# EasyEDA schematic NixieClock_v1.02_easyEDA.json
TITLE: Nixie Tube; REV: 1.0; Date: 2018-09-02; Sheet: 1/1; Drawn By: lc85301
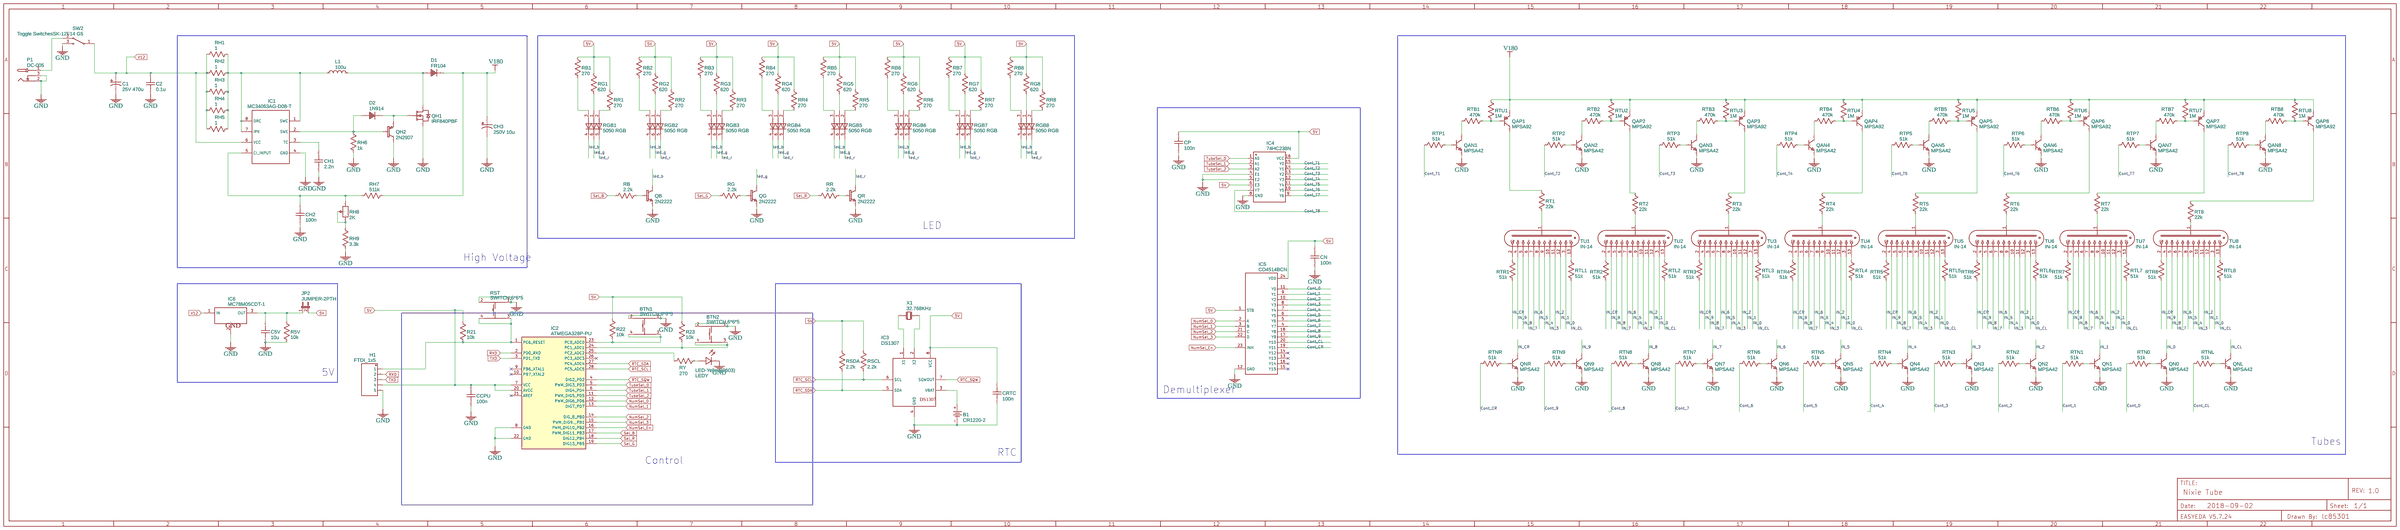
[diagram p0: schematic sheet]

## Parts
B1  CR1220-2  [BH5000_SMALL]
BTN1  SWITCH,6*6*5  [SWITCH-6X6X5_TH]
BTN2  SWITCH,6*6*5  [SWITCH-6X6X5_TH]
C1  25V 470u  [CAP-D8.0XF3.5]
C2  0.1u  [RAD-0.2]
C5V  10u  [RAD-0.2]
CCPU  100n  [0603]
CH1  2.2n  [RAD-0.2]
CH2  100n  [0603]
CH3  250V 10u  [CAP-D10.0XF5.0]
CN  100n  [0603]
CP  100n  [0603]
CRTC  100n  [0603]
D1  FR104  [DO-41]
D2  1N914  [DO-35]
H1  FTDI_1x5  [DIP-1X5P-2.54MM-M]
IC1  MC34063AG-D08-T  [DIL08]
IC2  ATMEGA328P-PU  [DIP28]
IC3  DS1307  [DIL08]
IC4  74HC238N  [DIP16-2.54-20.32X5.84MM]
IC5  CD4514BCN  [DIP24W]
IC6  MC78M05CDT-1  [369-03]
JP2  JUMPER-2PTH  [1X02]
L1  100u  [COIL-TOROID-100UH-6A]
LEDY  LED-Yellow(0603)  [LED-0603]
P1  DC-005  [DC-005]
QAN1  MPSA42  [TO-226AA]
QAN2  MPSA42  [TO-226AA]
QAN3  MPSA42  [TO-226AA]
QAN4  MPSA42  [TO-226AA]
QAN5  MPSA42  [TO-226AA]
QAN6  MPSA42  [TO-226AA]
QAN7  MPSA42  [TO-226AA]
QAN8  MPSA42  [TO-226AA]
QAP1  MPSA92  [TO-226AA]
QAP2  MPSA92  [TO-226AA]
QAP3  MPSA92  [TO-226AA]
QAP4  MPSA92  [TO-226AA]
QAP5  MPSA92  [TO-226AA]
QAP6  MPSA92  [TO-226AA]
QAP7  MPSA92  [TO-226AA]
QAP8  MPSA92  [TO-226AA]
QB  2N2222  [TO-92]
QG  2N2222  [TO-92]
QH1  IRF840PBF  [TO-220(TO-220-3)]
QH2  2N2907  [TO-226AA]
QN0  MPSA42  [TO-226AA]
QN1  MPSA42  [TO-226AA]
QN2  MPSA42  [TO-226AA]
QN3  MPSA42  [TO-226AA]
QN4  MPSA42  [TO-226AA]
QN5  MPSA42  [TO-226AA]
QN6  MPSA42  [TO-226AA]
QN7  MPSA42  [TO-226AA]
QN8  MPSA42  [TO-226AA]
QN9  MPSA42  [TO-226AA]
QNL  MPSA42  [TO-226AA]
QNR  MPSA42  [TO-226AA]
QR  2N2222  [TO-92]
R5V  10k  [0603]
R21  10k  [0603]
R22  10k  [0603]
R23  10k  [0603]
RB  2.2k  [0603]
RB1  270  [R_0603]
RB2  270  [R_0603]
RB3  270  [R_0603]
RB4  270  [R_0603]
RB5  270  [R_0603]
RB6  270  [R_0603]
RB7  270  [R_0603]
RB8  270  [R_0603]
RG  2.2k  [0603]
RG1  620  [R_0603]
RG2  620  [R_0603]
RG3  620  [R_0603]
RG4  620  [R_0603]
RG5  620  [R_0603]
RG6  620  [R_0603]
RG7  620  [R_0603]
RG8  620  [R_0603]
RGB1  5050 RGB  [5050_KINGBRIGHT]
RGB2  5050 RGB  [5050_KINGBRIGHT]
RGB3  5050 RGB  [5050_KINGBRIGHT]
RGB4  5050 RGB  [5050_KINGBRIGHT]
RGB5  5050 RGB  [5050_KINGBRIGHT]
RGB6  5050 RGB  [5050_KINGBRIGHT]
RGB7  5050 RGB  [5050_KINGBRIGHT]
RGB8  5050 RGB  [5050_KINGBRIGHT]
RH1  1  [1206]
RH2  1  [1206]
RH3  1  [1206]
RH4  1  [1206]
RH5  1  [1206]
RH6  1k  [AXIAL-0.4]
RH7  511k  [AXIAL-0.4]
RH8  2K  [RES-ADJ_3362P]
RH9  3.3k  [AXIAL-0.4]
RR  2.2k  [0603]
RR1  270  [R_0603]
RR2  270  [R_0603]
RR3  270  [R_0603]
RR4  270  [R_0603]
RR5  270  [R_0603]
RR6  270  [R_0603]
RR7  270  [R_0603]
RR8  270  [R_0603]
RSCL  2.2k  [0603]
RSDA  2.2k  [0603]
RST  SWITCH,6*6*5  [SWITCH-6X6X5_TH]
RT1  22k  [R_0603]
RT2  22k  [R_0603]
RT3  22k  [R_0603]
RT4  22k  [R_0603]
RT5  22k  [R_0603]
RT6  22k  [R_0603]
RT7  22k  [R_0603]
RT8  22k  [R_0603]
RTB1  470k  [R_0603]
RTB2  470k  [R_0603]
RTB3  470k  [R_0603]
RTB4  470k  [R_0603]
RTB5  470k  [R_0603]
RTB6  470k  [R_0603]
RTB7  470k  [R_0603]
RTB8  470k  [R_0603]
RTL1  51k  [R_0603]
RTL2  51k  [R_0603]
RTL3  51k  [R_0603]
RTL4  51k  [R_0603]
RTL5  51k  [R_0603]
RTL6  51k  [R_0603]
RTL7  51k  [R_0603]
RTL8  51k  [R_0603]
RTN0  51k  [R_0603]
RTN1  51k  [R_0603]
RTN2  51k  [R_0603]
RTN3  51k  [R_0603]
RTN4  51k  [R_0603]
RTN5  51k  [R_0603]
RTN6  51k  [R_0603]
RTN7  51k  [R_0603]
RTN8  51k  [R_0603]
RTN9  51k  [R_0603]
RTNL  51k  [R_0603]
RTNR  51k  [R_0603]
RTP1  51k  [R_0603]
RTP2  51k  [R_0603]
RTP3  51k  [R_0603]
RTP4  51k  [R_0603]
RTP5  51k  [R_0603]
RTP6  51k  [R_0603]
RTP7  51k  [R_0603]
RTP8  51k  [R_0603]
RTR1  51k  [R_0603]
RTR2  51k  [R_0603]
RTR3  51k  [R_0603]
RTR4  51k  [R_0603]
RTR5  51k  [R_0603]
RTR6  51k  [R_0603]
RTR7  51k  [R_0603]
RTR8  51k  [R_0603]
RTU1  1M  [R_0603]
RTU2  1M  [R_0603]
RTU3  1M  [R_0603]
RTU4  1M  [R_0603]
RTU5  1M  [R_0603]
RTU6  1M  [R_0603]
RTU7  1M  [R_0603]
RTU8  1M  [R_0603]
RY  270  [0603]
SW2  Toggle SwitchesSK-12F14 G5  [SK-12F14-G]
TU1  IN-14  [NIXIE-SOCKEL]
TU2  IN-14  [NIXIE-SOCKEL]
TU3  IN-14  [NIXIE-SOCKEL]
TU4  IN-14  [NIXIE-SOCKEL]
TU5  IN-14  [NIXIE-SOCKEL]
TU6  IN-14  [NIXIE-SOCKEL]
TU7  IN-14  [NIXIE-SOCKEL]
TU8  IN-14  [NIXIE-SOCKEL]
X1  32.768KHz  [CRYSTAL_AT310_D3.0MM_L10.0MM_VERTICAL]

## Library data of the parts
B1 = -: Supplier: LCSC; Manufacturer: Q&J; image: //image.lceda.cn/szlcsc/C70381.jpg; Contributor: LCSC; Supplier Part: C70381
BTN1 BTN2 RST = -: Supplier: LCSC; Manufacturer: BBJ; Manufacturer Part: Switch,6*6*5Plastic head,260G, 0.25mm,DIP2; Contributor: LCSC; Supplier Part: C71845
C1 = Cap_Electrolytic(TH)_D8.0XF3.5_US: Manufacturer Part: ?
C2 CH1 = Cap_RAD-0.2_US: Manufacturer Part: ?
C5V CCPU CN CP CRTC = Cap_RAD-0.1_US: Manufacturer Part: ?
CH2 = Cap_0603_US: Manufacturer Part: ?
CH3 = Cap_Electrolytic(TH)_D10.0XF5.0_US: Manufacturer Part: ?
D1 = -: Supplier: LCSC; Manufacturer: MDD; image: //image.lceda.cn/szlcsc/C2465.jpg; Contributor: LCSC; Supplier Part: C2465
D2 = -: Supplier: LCSC; Manufacturer: FAIRCHILD; Contributor: LCSC; Supplier Part: C96325
H1 = -: Supplier Part: C124379; Supplier: LCSC; Manufacturer: Ckmtw; Manufacturer Part: 210S-1*5P L=11.6MMGold-plated black; Contributor: LCSC
IC1 = -: Supplier: LCSC; Manufacturer: UTC; image: //image.lceda.cn/szlcsc/C71110.jpg; Contributor: LCSC; Supplier Part: C71110
IC2 = -: sourceId: Oic6oiASL; Supplier: LCSC; Manufacturer: MICROCHIP; image: //image.lceda.cn/szlcsc/C33901.jpg; Contributor: LCSC; Supplier Part: C33901
IC3 QB QG QH2 QR = -: Contributor: Adafruit; Manufacturer Part: ?
IC4 = -: Manufacturer Part: ?
IC5 = -: 4 Bit Latched4-to-16-Line Decoder; Manufacturer Part: ?
IC6 = -: 3-Terminal Medium-Current Positive Fixed Voltage Regulator; Manufacturer Part: ?
JP2 = -: Jumper; Contributor: SparkFun; Manufacturer Part: ?
L1 = Inductor_AXIAL-0.6_US: Manufacturer Part: ?
LEDY = -: Supplier Part: C72038; Supplier: LCSC; Manufacturer: EVERLIGHT; Manufacturer Part: 19-213/Y2C-CQ2R2L/3T(CY)
P1 = -: Supplier Part: undefined; Supplier: EasyEDA; Manufacturer: EasyEDA
QAN1-QAN8 QN0-QN9 QNL QNR = -: Supplier: LCSC; Manufacturer: SEMTECH; Contributor: LCSC; Supplier Part: C118557
QAP1-QAP8 = -: Supplier: LCSC; Manufacturer: SEMTECH; Contributor: LCSC; Supplier Part: C118558
QH1 = -: Supplier: LCSC; Manufacturer: VISHAY; image: //image.lceda.cn/szlcsc/C2604.jpg; Contributor: LCSC; Supplier Part: C2604
R5V R21-R23 RB RB1-RB8 RG RG1-RG8 RH1-RH5 RR RR1-RR8 RSCL RSDA RT1-RT8 RTB1-RTB8 RTL1-RTL8 RTN0-RTN9 RTNL RTNR RTP1-RTP8 RTR1-RTR8 RTU1-RTU8 RY = Res_0603(1/10W)_US: Manufacturer Part: ?
RGB1-RGB8 = -: Contributor: frederic.vigreux; Manufacturer Part: ?
RH6 RH7 RH9 = Res_AXIAL-0.4(1/4W)_US: Manufacturer Part: ?
RH8 = 3362X-1-202LF: Supplier: LCSC; Manufacturer: BOURNS; Contributor: LCSC; Supplier Part: C123863
SW2 = -: Supplier Part: undefined; Supplier: LCSC; Manufacturer: ReliaPro; image: http://image.lceda.cn/szlcsc/C59902.jpg
TU1-TU8 = -: Contributor: mr.santiaga
X1 = DT-26 32.768KHz: Supplier: LCSC; Manufacturer: KDS; Contributor: LCSC; Supplier Part: C93229

## Nets
5V: CCPU.2 CN.2 CP.2 CRTC.2 H1.4 IC2.7(VCC) IC2.20(AVCC) IC3.8(VCC) IC4.6(E3) IC4.16(VCC) IC5.1(STB) IC5.24(VDD) JP2.2 R21.1 R22.1 R23.1 RB1.1 RB2.1 RB3.1 RB4.1 RB5.1 RB6.1 RB7.1 RB8.1 RG1.1 RG2.1 RG3.1 RG4.1 RG5.1 RG6.1 RG7.1 RG8.1 RR1.1 RR2.1 RR3.1 RR4.1 RR5.1 RR6.1 RR7.1 RR8.1 RSCL.1 RSDA.1
GND: B1.-(2) BTN1.1 BTN1.2 BTN2.1 BTN2.2 C1.2 C2.1 C5V.1 CCPU.1 CH1.1 CH2.1 CH3.2 CN.1 CP.1 CRTC.1 H1.5 IC1.4(GND) IC2.8(GND) IC2.22(GND) IC3.4(GND) IC4.4(E1) IC4.5(E2) IC4.8(GND) IC5.12(GND) IC6.2(GND) LEDY.2(-) P1.2 P1.3 QAN1.1(E) QAN2.1(E) QAN3.1(E) QAN4.1(E) QAN5.1(E) QAN6.1(E) QAN7.1(E) QAN8.1(E) QB.3(E) QG.3(E) QH1.3(S) QH2.1(C) QN0.1(E) QN1.1(E) QN2.1(E) QN3.1(E) QN4.1(E) QN5.1(E) QN6.1(E) QN7.1(E) QN8.1(E) QN9.1(E) QNL.1(E) QNR.1(E) QR.3(E) R5V.2 RH6.2 RH9.1 RST.1 RST.2 SW2.3
V12: C1.1 C2.2 IC1.6(VCC) IC6.1(IN) RH1.1 RH2.1 RH3.1 RH4.1 RH5.1 SW2.1
V180: CH3.1 D1.2(K) QAP1.1 QAP2.1 QAP3.1 QAP4.1 QAP5.1 QAP6.1 QAP7.1 QAP8.1 RH7.2 RTU1.1 RTU2.1 RTU3.1 RTU4.1 RTU5.1 RTU6.1 RTU7.1 RTU8.1
Cont_0: IC5.11(Y0) RTN0.1
Cont_1: IC5.9(Y1) RTN1.1
Cont_2: IC5.10(Y2) RTN2.1
Cont_3: IC5.8(Y3) RTN3.1
Cont_4: IC5.7(Y4) RTN4.1
Cont_5: IC5.6(Y5) RTN5.1
Cont_6: IC5.5(Y6) RTN6.1
Cont_7: IC5.4(Y7) RTN7.1
Cont_8: IC5.18(Y8) RTN8.1
Cont_9: IC5.17(Y9) RTN9.1
Cont_CL: IC5.20(Y10) RTNL.1
Cont_CR: IC5.19(Y11) RTNR.1
Cont_T1: IC4.15(Y0) RTP1.1
Cont_T2: IC4.14(Y1) RTP2.1
Cont_T3: IC4.13(Y2) RTP3.1
Cont_T4: IC4.12(Y3) RTP4.1
Cont_T5: IC4.11(Y4) RTP5.1
Cont_T6: IC4.10(Y5) RTP6.1
Cont_T7: IC4.9(Y6) RTP7.1
Cont_T8: IC4.7(Y7) RTP8.1
IN_0: QN0.3(C) TU1.3 TU2.3 TU3.3 TU4.3 TU5.3 TU6.3 TU7.3 TU8.3
IN_1: QN1.3(C) TU1.12(4) TU2.12(4) TU3.12(4) TU4.12(4) TU5.12(4) TU6.12(4) TU7.12(4) TU8.12(4)
IN_2: QN2.3(C) TU1.11(5) TU2.11(5) TU3.11(5) TU4.11(5) TU5.11(5) TU6.11(5) TU7.11(5) TU8.11(5)
IN_3: QN3.3(C) TU1.10(6) TU2.10(6) TU3.10(6) TU4.10(6) TU5.10(6) TU6.10(6) TU7.10(6) TU8.10(6)
IN_4: QN4.3(C) TU1.9(7) TU2.9(7) TU3.9(7) TU4.9(7) TU5.9(7) TU6.9(7) TU7.9(7) TU8.9(7)
IN_5: QN5.3(C) TU1.8 TU2.8 TU3.8 TU4.8 TU5.8 TU6.8 TU7.8 TU8.8
IN_6: QN6.3(C) TU1.7(9) TU2.7(9) TU3.7(9) TU4.7(9) TU5.7(9) TU6.7(9) TU7.7(9) TU8.7(9)
IN_7: QN7.3(C) TU1.6(10) TU2.6(10) TU3.6(10) TU4.6(10) TU5.6(10) TU6.6(10) TU7.6(10) TU8.6(10)
IN_8: QN8.3(C) TU1.5(11) TU2.5(11) TU3.5(11) TU4.5(11) TU5.5(11) TU6.5(11) TU7.5(11) TU8.5(11)
IN_9: QN9.3(C) TU1.4(12) TU2.4(12) TU3.4(12) TU4.4(12) TU5.4(12) TU6.4(12) TU7.4(12) TU8.4(12)
IN_CL: QNL.3(C) RTL1.2 RTL2.2 RTL3.2 RTL4.2 RTL5.2 RTL6.2 RTL7.2 RTL8.2
IN_CR: QNR.3(C) RTR1.2 RTR2.2 RTR3.2 RTR4.2 RTR5.2 RTR6.2 RTR7.2 RTR8.2
led_b: QB.1(C) RGB1.4(B) RGB2.4(B) RGB3.4(B) RGB4.4(B) RGB5.4(B) RGB6.4(B) RGB7.4(B) RGB8.4(B)
led_g: QG.1(C) RGB1.6(V) RGB2.6(V) RGB3.6(V) RGB4.6(V) RGB5.6(V) RGB6.6(V) RGB7.6(V) RGB8.6(V)
led_r: QR.1(C) RGB1.5(R) RGB2.5(R) RGB3.5(R) RGB4.5(R) RGB5.5(R) RGB6.5(R) RGB7.5(R) RGB8.5(R)
NumSel_0: IC2.12(PWM DIG6 PD6) IC5.2(A)
NumSel_1: IC2.13(DIG7 PD7) IC5.3(B)
NumSel_2: IC2.14(DIG 8 PB0) IC5.21(C)
NumSel_3: IC2.15(PWM DIG9  PB1) IC5.22(D)
NumSel_En: IC2.16(PWM DIG10 PB2) IC5.23(INH)
RTC_SCL: IC2.28(PC5 ADC5) IC3.6(SCL) RSCL.2
RTC_SDA: IC2.27(PC4 ADC4) IC3.5(SDA) RSDA.2
RTC_SQW: IC2.4(DIG2 PD2) IC3.7(SQWOUT)
RXD: H1.2 IC2.2(PD0 RXD)
Sel_B: IC2.17(PWM DIG11 PB3) RB.1
Sel_G: IC2.19(DIG13 PB5) RG.1
Sel_R: IC2.18(DIG12 PB4) RR.1
TubeSel_0: IC2.5(PWM DIG3 PD3) IC4.1(A0)
TubeSel_1: IC2.6(DIG4 PD4) IC4.2(A1)
TubeSel_2: IC2.11(PWM DIG5 PD5) IC4.3(A2)
TXD: H1.3 IC2.3(PD1 TXD)
Net-(B1-+): B1.+(1) IC3.3(VBAT)
Net-(BTN1-3): BTN1.3 BTN1.4 IC2.23(PC0 ADC0) R22.2
Net-(BTN2-3): BTN2.3 BTN2.4 IC2.24(PC1 ADC1) R23.2
Net-(C5V-2): C5V.2 IC6.3(OUT) JP2.1 R5V.1
Net-(CH1-2): CH1.2 IC1.3(TC)
Net-(CH2-2): CH2.2 IC1.5(CI INPUT) RH7.1 RH8.1
Net-(D1-1): D1.1(A) L1.2 QH1.2(D)
Net-(D2-1): D2.1(A) IC1.2(SWE) QH2.2(B) RH6.1
Net-(D2-2): D2.2(K) QH1.1(G) QH2.3(E)
Net-(H1-1): H1.1 IC2.1(PC6 RESET) R21.2 RST.3 RST.4
Net-(IC1-1): IC1.1(SWC) IC1.7(IPK) IC1.8(DRC) L1.1 RH1.2 RH2.2 RH3.2 RH4.2 RH5.2
Net-(IC2-25): IC2.25(PC2 ADC2) RY.1
Net-(IC3-1): IC3.1(X1) X1.2(OSC2)
Net-(IC3-2): IC3.2(X2) X1.1(OSC1)
Net-(LEDY-1): LEDY.1(+) RY.2
Net-(P1-1): P1.1 SW2.2
Net-(QAN1-2): QAN1.2(B) RTP1.2
Net-(QAN1-3): QAN1.3(C) RTB1.1
Net-(QAN2-2): QAN2.2(B) RTP2.2
Net-(QAN2-3): QAN2.3(C) RTB2.1
Net-(QAN3-2): QAN3.2(B) RTP3.2
Net-(QAN3-3): QAN3.3(C) RTB3.1
Net-(QAN4-2): QAN4.2(B) RTP4.2
Net-(QAN4-3): QAN4.3(C) RTB4.1
Net-(QAN5-2): QAN5.2(B) RTP5.2
Net-(QAN5-3): QAN5.3(C) RTB5.1
Net-(QAN6-2): QAN6.2(B) RTP6.2
Net-(QAN6-3): QAN6.3(C) RTB6.1
Net-(QAN7-2): QAN7.2(B) RTP7.2
Net-(QAN7-3): QAN7.3(C) RTB7.1
Net-(QAN8-2): QAN8.2(B) RTP8.2
Net-(QAN8-3): QAN8.3(C) RTB8.1
Net-(QAP1-2): QAP1.2 RTB1.2 RTU1.2
Net-(QAP1-3): QAP1.3 RT1.1
Net-(QAP2-2): QAP2.2 RTB2.2 RTU2.2
Net-(QAP2-3): QAP2.3 RT2.1
Net-(QAP3-2): QAP3.2 RTB3.2 RTU3.2
Net-(QAP3-3): QAP3.3 RT3.1
Net-(QAP4-2): QAP4.2 RTB4.2 RTU4.2
Net-(QAP4-3): QAP4.3 RT4.1
Net-(QAP5-2): QAP5.2 RTB5.2 RTU5.2
Net-(QAP5-3): QAP5.3 RT5.1
Net-(QAP6-2): QAP6.2 RTB6.2 RTU6.2
Net-(QAP6-3): QAP6.3 RT6.1
Net-(QAP7-2): QAP7.2 RTB7.2 RTU7.2
Net-(QAP7-3): QAP7.3 RT7.1
Net-(QAP8-2): QAP8.2 RTB8.2 RTU8.2
Net-(QAP8-3): QAP8.3 RT8.1
Net-(QB-2): QB.2(B) RB.2
Net-(QG-2): QG.2(B) RG.2
Net-(QN0-2): QN0.2(B) RTN0.2
Net-(QN1-2): QN1.2(B) RTN1.2
Net-(QN2-2): QN2.2(B) RTN2.2
Net-(QN3-2): QN3.2(B) RTN3.2
Net-(QN4-2): QN4.2(B) RTN4.2
Net-(QN5-2): QN5.2(B) RTN5.2
Net-(QN6-2): QN6.2(B) RTN6.2
Net-(QN7-2): QN7.2(B) RTN7.2
Net-(QN8-2): QN8.2(B) RTN8.2
Net-(QN9-2): QN9.2(B) RTN9.2
Net-(QNL-2): QNL.2(B) RTNL.2
Net-(QNR-2): QNR.2(B) RTNR.2
Net-(QR-2): QR.2(B) RR.2
Net-(RB1-2): RB1.2 RGB1.3(1)
Net-(RB2-2): RB2.2 RGB2.3(1)
Net-(RB3-2): RB3.2 RGB3.3(1)
Net-(RB4-2): RB4.2 RGB4.3(1)
Net-(RB5-2): RB5.2 RGB5.3(1)
Net-(RB6-2): RB6.2 RGB6.3(1)
Net-(RB7-2): RB7.2 RGB7.3(1)
Net-(RB8-2): RB8.2 RGB8.3(1)
Net-(RG1-2): RG1.2 RGB1.1(2)
Net-(RG2-2): RG2.2 RGB2.1(2)
Net-(RG3-2): RG3.2 RGB3.1(2)
Net-(RG4-2): RG4.2 RGB4.1(2)
Net-(RG5-2): RG5.2 RGB5.1(2)
Net-(RG6-2): RG6.2 RGB6.1(2)
Net-(RG7-2): RG7.2 RGB7.1(2)
Net-(RG8-2): RG8.2 RGB8.1(2)
Net-(RGB1-2): RGB1.2(3) RR1.2
Net-(RGB2-2): RGB2.2(3) RR2.2
Net-(RGB3-2): RGB3.2(3) RR3.2
Net-(RGB4-2): RGB4.2(3) RR4.2
Net-(RGB5-2): RGB5.2(3) RR5.2
Net-(RGB6-2): RGB6.2(3) RR6.2
Net-(RGB7-2): RGB7.2(3) RR7.2
Net-(RGB8-2): RGB8.2(3) RR8.2
Net-(RH8-2): RH8.2 RH8.3 RH9.2
Net-(RT1-2): RT1.2 TU1.1
Net-(RT2-2): RT2.2 TU2.1
Net-(RT3-2): RT3.2 TU3.1
Net-(RT4-2): RT4.2 TU4.1
Net-(RT5-2): RT5.2 TU5.1
Net-(RT6-2): RT6.2 TU6.1
Net-(RT7-2): RT7.2 TU7.1
Net-(RT8-2): RT8.2 TU8.1
Net-(RTL1-1): RTL1.1 TU1.13(2)
Net-(RTL2-1): RTL2.1 TU2.13(2)
Net-(RTL3-1): RTL3.1 TU3.13(2)
Net-(RTL4-1): RTL4.1 TU4.13(2)
Net-(RTL5-1): RTL5.1 TU5.13(2)
Net-(RTL6-1): RTL6.1 TU6.13(2)
Net-(RTL7-1): RTL7.1 TU7.13(2)
Net-(RTL8-1): RTL8.1 TU8.13(2)
Net-(RTR1-1): RTR1.1 TU1.2(13)
Net-(RTR2-1): RTR2.1 TU2.2(13)
Net-(RTR3-1): RTR3.1 TU3.2(13)
Net-(RTR4-1): RTR4.1 TU4.2(13)
Net-(RTR5-1): RTR5.1 TU5.2(13)
Net-(RTR6-1): RTR6.1 TU6.2(13)
Net-(RTR7-1): RTR7.1 TU7.2(13)
Net-(RTR8-1): RTR8.1 TU8.2(13)

Not connected (* = marked no-connect by the designer): IC2 9(PB6 XTAL1)* 10(PB7 XTAL2)* 21(AREF)* 26(PC3 ADC3)*; IC5 13(Y13)* 14(Y12)* 15(Y15)* 16(Y14)*

## Notes on the sheet
- LED
- High Voltage
- 5V
- Demultiplexer
- Tubes
- RTC
- Control
